# EAGLE schematic 555_556_Tester (EAGLE 8.1.0)
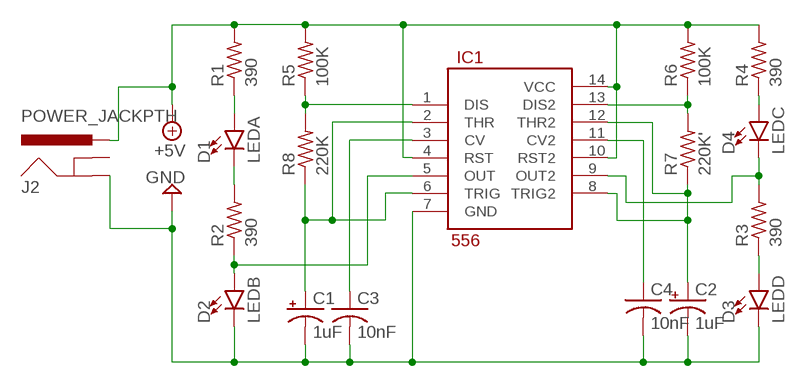
[diagram p0: schematic, sheet 1]

## Parts
C1  1uF  CPOL-USE2-4  [E2-4]
C2  1uF  CPOL-USE2-4  [E2-4]
C3  10nF  C-US025-025X050  [C025-025X050]
C4  10nF  C-US025-025X050  [C025-025X050]
D1  LEDA  LED3MM  [LED_3MM]
D2  LEDB  LED3MM  [LED_3MM]
D3  LEDD  LED3MM  [LED_3MM]
D4  LEDC  LED3MM  [LED_3MM]
IC1  556  556KIT  [DIL14-KIT]
J2  POWER_JACKPTH  [POWER_JACK_PTH]
R1  390  R-US_0204/5  [0204/5]
R2  390  R-US_0204/5  [0204/5]
R3  390  R-US_0204/5  [0204/5]
R4  390  R-US_0204/5  [0204/5]
R5  100K  R-US_0204/5  [0204/5]
R6  100K  R-US_0204/5  [0204/5]
R7  220K'  R-US_0204/5  [0204/5]
R8  220K  R-US_0204/5  [0204/5]

## Nets
+5V: IC1.4(RST) IC1.10(RST2) IC1.14(VCC) J2.PWR R1.2 R4.2 R5.2 R6.2
GND: C1.- C2.- C3.2 C4.2 D2.K(C) D3.K(C) IC1.7(GND) J2.GND
N$1: D4.A R4.1
N$2: D4.K(C) IC1.9(OUT2) R3.2
N$3: D3.A R3.1
N$4: C1.+ IC1.2(THR) IC1.6(TRIG) R8.1
N$5: D2.A IC1.5(OUT) R2.1
N$6: D1.K(C) R2.2
N$7: D1.A R1.1
N$8: IC1.1(DIS) R5.1 R8.2
N$9: C2.+ IC1.8(TRIG2) IC1.12(THR2) R7.1
N$10: IC1.13(DIS2) R6.1 R7.2
N$11: C4.1 IC1.11(CV2)
N$12: C3.1 IC1.3(CV)
Unconnected: J2.GNDBREAK

## Library data of the parts
C1 C2 = adafruit:CPOL-US: POLARIZED CAPACITOR, American symbol
C3 C4 = adafruit:C-US: CAPACITOR, American symbol
D1-D4 = SparkFun-LED:LED: LED (Generic) Standard schematic elements and footprints for 5mm, 3mm, 1206, and 0603 sized LEDs. Generic LEDs with no color specified.; PROD_ID: DIO-08794
IC1 = SparkFun-AnalogIC:556: Dual timer circuit (2 555 timers in one package)
J2 = SparkFun-Connectors:POWER_JACK: Power Jack This is the standard 5.5mm barrel jack for power. The PTH is the most common, proven, reliable, footprint. The Slot footprint only works if the mill layer is transmitted to the PCB fab house so be warned. Mating wall wart : TOL-00298 (and others); PROD_ID: CONN-08197
R1-R8 = adafruit:R-US_: RESISTOR, American symbol